# EAGLE design SensorBoard (EAGLE 9.4.1)
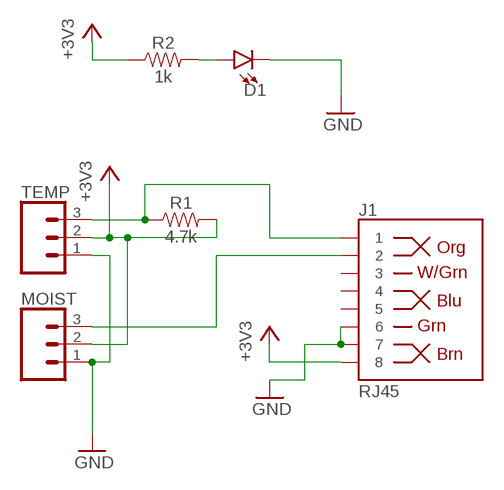
[diagram p0: schematic, sheet 1]

## Parts
D1  LED3MM  [LED_3MM]
J1  RJ45  RJ45-8  [RJ45-8]
MOIST  CONN_03  [1X03]
R1  4.7k  1KOHM-HORIZ-1/4W-1%  [AXIAL-0.3]
R2  1k  1KOHM-HORIZ-1/4W-1%  [AXIAL-0.3]
TEMP  CONN_03  [1X03]

## Nets
+3V3: J1.8 MOIST.2 R1.P$2 R2.P$1 TEMP.2
GND: D1.K(C) J1.6 J1.7 MOIST.1 TEMP.1
N$1: J1.2 MOIST.3
N$3: D1.A R2.P$2
N$4: J1.1 R1.P$1 TEMP.3
Unconnected: J1.3 J1.4 J1.5

## Library data of the parts
D1 = SparkFun-LED:LED: LED (Generic) Standard schematic elements and footprints for 5mm, 3mm, 1206, and 0603 sized LEDs. Generic LEDs with no color specified.; PROD_ID: DIO-08794
J1 = SparkFun-Connectors:RJ45-8: RJ45 Jack - 8 pin Simple RJ45, 8-pin connection. Commonly used for Cat5, Cat5e, and Cat6 Ethernet cables. Here is the connector we sell at SparkFun: RJ45 8-Pin Connector <https://www.sparkfun.com/products/643> (PRT-00643) Datasheet <https://cdn.sparkfun.com/datasheets/Prototyping/04908.pdf> It is used on this SparkFun product: SparkFun RJ45 Breakout <https://www.sparkfun.com/products/716> (BOB-00716) Note, you may also be interested in the "MAGJACK" version of this. It is basically a RJ45 connector, but also has some status LEDs built into the connector housing. You can check that out in this library at the device named "MAGJACK.dev" and see these products online: RJ45 Ethernet MagJack-Compatible <https://www.sparkfun.com/products/8534> (PRT-08534) SparkFun RJ45 MagJack Breakout <https://www.sparkfun.com/products/13021> (BOB-13021); PROD_ID: CONN-08506; SF_ID: PRT-00643
MOIST TEMP = SparkFun-Connectors:CONN_03: Multi connection point. Often used as Generic Header-pin footprint for 0.1 inch spaced/style header connections On any of the 0.1 inch spaced packages, you can populate with these: Break Away Headers - Straight <https://www.sparkfun.com/products/116> (PRT-00116) Break Away Male Headers - Right Angle <https://www.sparkfun.com/products/553> (PRT-00553) Female Headers <https://www.sparkfun.com/products/115> (PRT-00115) Break Away Headers - Machine Pin <https://www.sparkfun.com/products/117> (PRT-00117) Break Away Female Headers - Swiss Machine Pin <https://www.sparkfun.com/products/743> (PRT-00743) Stackable Header - 3 Pin (Female, 0.1") <https://www.sparkfun.com/products/13875> (PRT-13875) For SCREWTERMINALS and SPRING TERMINALS visit here: Screw Terimnals on SparkFun.com <https://www.sparkfun.com/search/results?term=Screw+Terminals> (5mm/3.5mm/2.54mm spacing) This device is also useful as a general connection point to wire up your design to another part of your project. Our various solder wires solder well into these plated through hole pads. Hook-Up Wire - Assortment (Stranded, 22 AWG) <https://www.sparkfun.com/products/11375> (PRT-11375) Hook-Up Wire - Assortment (Solid Core, 22 AWG) <https://www.sparkfun.com/products/11367> (PRT-11367) View the entire wire category on our website here <https://www.sparkfun.com/categories/141> Special notes: Molex polarized connector foot print use with SKU : PRT-08232 with associated crimp pins and housings.
R1 = SparkFun-Resistors:1KOHM: 1kΩ resistor A resistor is a passive two-terminal electrical component that implements electrical resistance as a circuit element. Resistors act to reduce current flow, and, at the same time, act to lower voltage levels within circuits. - Wikipedia; PROD_ID: RES-12182; VALUE: 1k
R2 = SparkFun-Resistors:1KOHM: 1kΩ resistor A resistor is a passive two-terminal electrical component that implements electrical resistance as a circuit element. Resistors act to reduce current flow, and, at the same time, act to lower voltage levels within circuits. - Wikipedia; PROD_ID: RES-12182

## Board
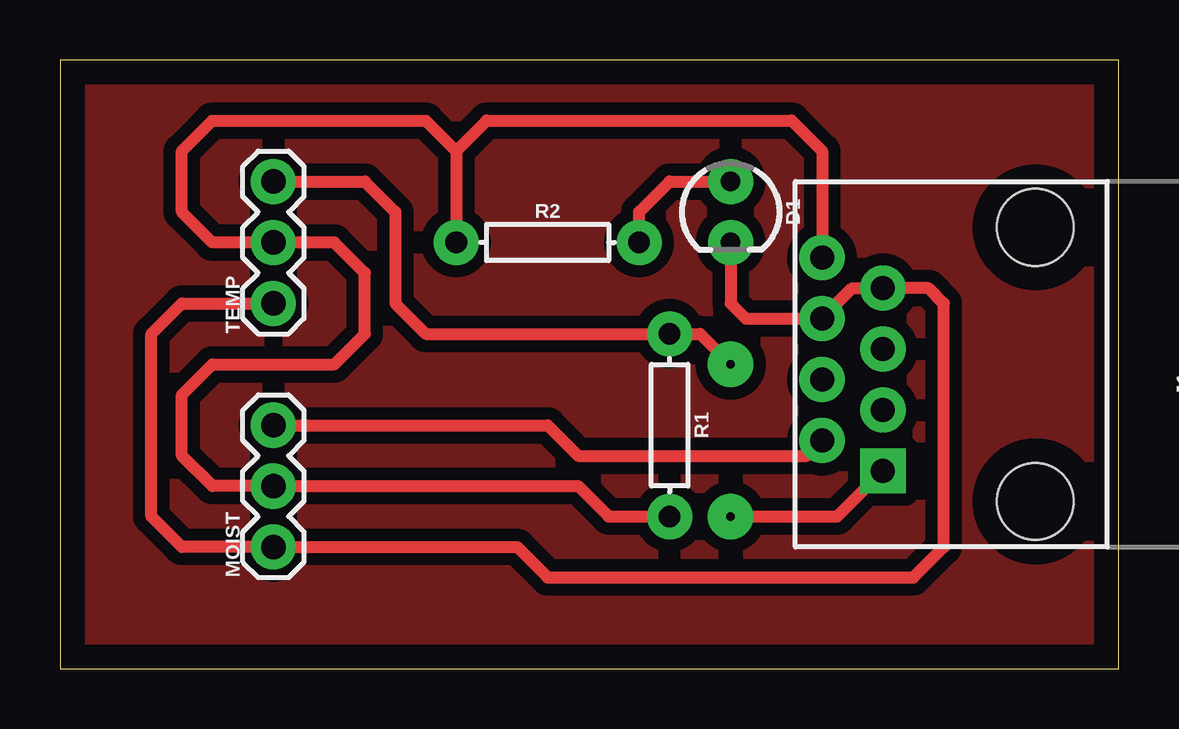
[diagram p1: board, top side]
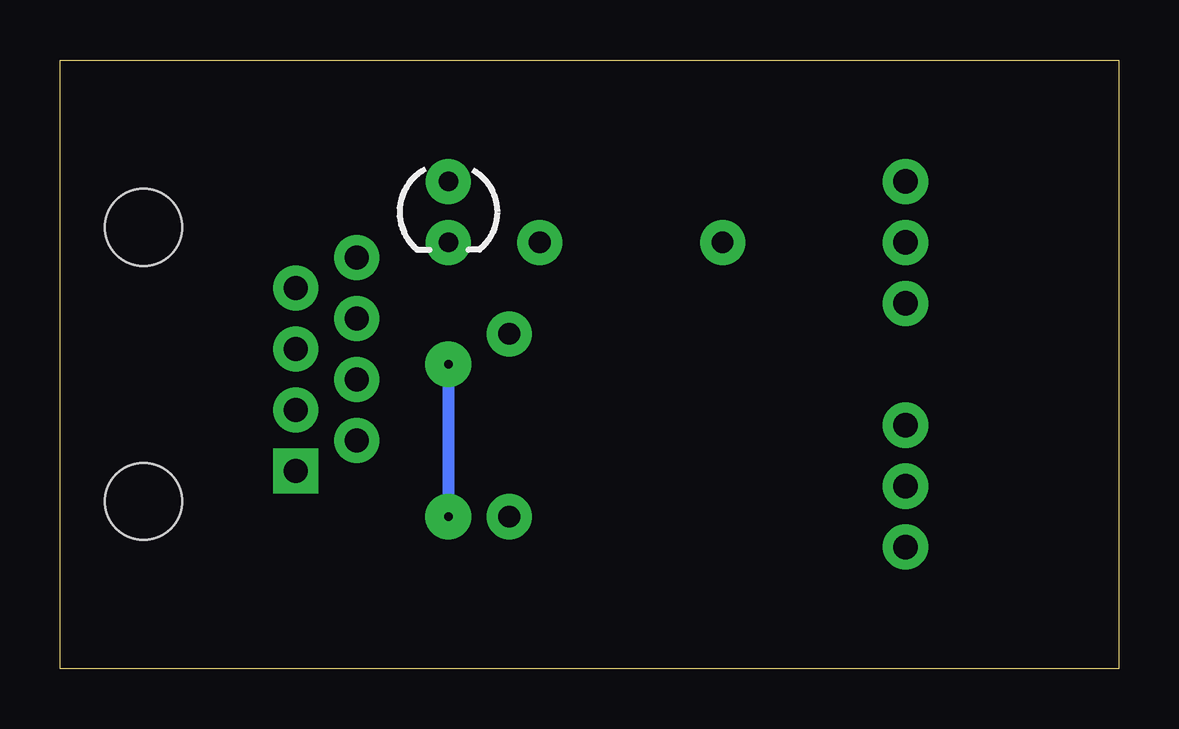
[diagram p2: board, bottom side, seen from below]

Size 44.12 x 25.39 mm. Coordinates in mm from the lower left corner, seen from the top.
Outline: 0,0 44.12,0 44.12,25.39 0,25.39 0,0
Copper layers (1*16): Top 0.035mm / dielectric 1.5mm / Bottom 0.035mm
Design rules "default": minimum track width 6mil, minimum drill 0.35mm, track to track 6mil, track to pad 6mil, pad to pad 6mil, via to via 6mil, smd to smd 6mil, copper to edge 40mil, drill to drill 6mil, minimum pad ring 10mil, minimum via ring 8mil, stop-mask expansion 4mil, vias tented up to drill 0mil, thermal gap 10mil

### Footprints (pad centres in the part's own frame; a part is rotated, then mirrored left to right if it is on the bottom)
LED_3MM = drill 0.813 pad 1.88: A -1.27,0; K 1.27,0
RJ45-8 = drill 1 pad 1.88 square: 1 -4.445,6.35 | drill 1 pad 1.88: 2 -3.175,8.89; 3 -1.905,6.35; 4 -0.635,8.89; 5 0.635,6.35; 6 1.905,8.89; 7 3.175,6.35; 8 4.445,8.89 | hole 3.2: -5.715,0; 5.715,0
1X03 = drill 1.016 pad 1.88: 1 0,0; 2 2.54,0; 3 5.08,0
AXIAL-0.3 = drill 0.9 pad 1.88: P$1 -3.81,0; P$2 3.81,0

### Placement (x,y rotation side)
D1  27.94,19.05 270 top
J1  40.64,12.7 90 top
MOIST  8.89,5.08 90 top
R1  25.4,10.16 270 top
R2  20.32,17.78 0 top
TEMP  8.89,15.24 90 top

### Tracks (layer width: path | path; a pad name or v marks a point on that pad's centre or on a via)
+3V3
  Top 0.508: R1.P$2 22.86,6.35 21.59,7.62 MOIST.2 6.35,7.62 5.08,8.89 5.08,11.43 6.35,12.7 11.43,12.7 12.7,13.97 12.7,16.51 11.43,17.78 TEMP.2 6.35,17.78 5.08,19.05 5.08,21.59 6.34,22.85 15.24,22.85 16.51,21.58 | 16.51,21.58 R2.P$1 | 16.51,21.58 17.78,22.85 17.78,22.86 30.48,22.86 31.75,21.59 J1.8
GND
  Top 0.508: TEMP.1 5.08,15.24 3.81,13.97 3.81,6.35 5.08,5.08 MOIST.1 19.05,5.08 20.32,3.81 35.56,3.81 36.83,5.08 36.83,15.24 36.2,15.88 J1.7 33.02,15.88 J1.6 28.57,14.6 27.94,15.24 D1.K
N$1
  Top 0.508: MOIST.3 20.32,10.16 21.59,8.89 31.12,8.89 J1.2
N$3
  Top 0.508: R2.P$2 24.13,19.05 25.4,20.32 D1.A
N$4  (via drill 0.35 pad 1.91)
  Top 0.508: TEMP.3 12.7,20.32 13.97,19.05 13.97,15.24 15.24,13.97 R1.P$1 26.67,13.97 v27.94,12.7 | v27.94,6.35 32.38,6.35 J1.1
  Bottom 0.508: v27.94,12.7 v27.94,6.35
NEW
  pour Top (isolate 0.508): 0,25.4 44.45,25.4 44.45,0 0,0